# Altium schematic sheet loom-side-panel-right.SchDoc
size 297 x 209 mm
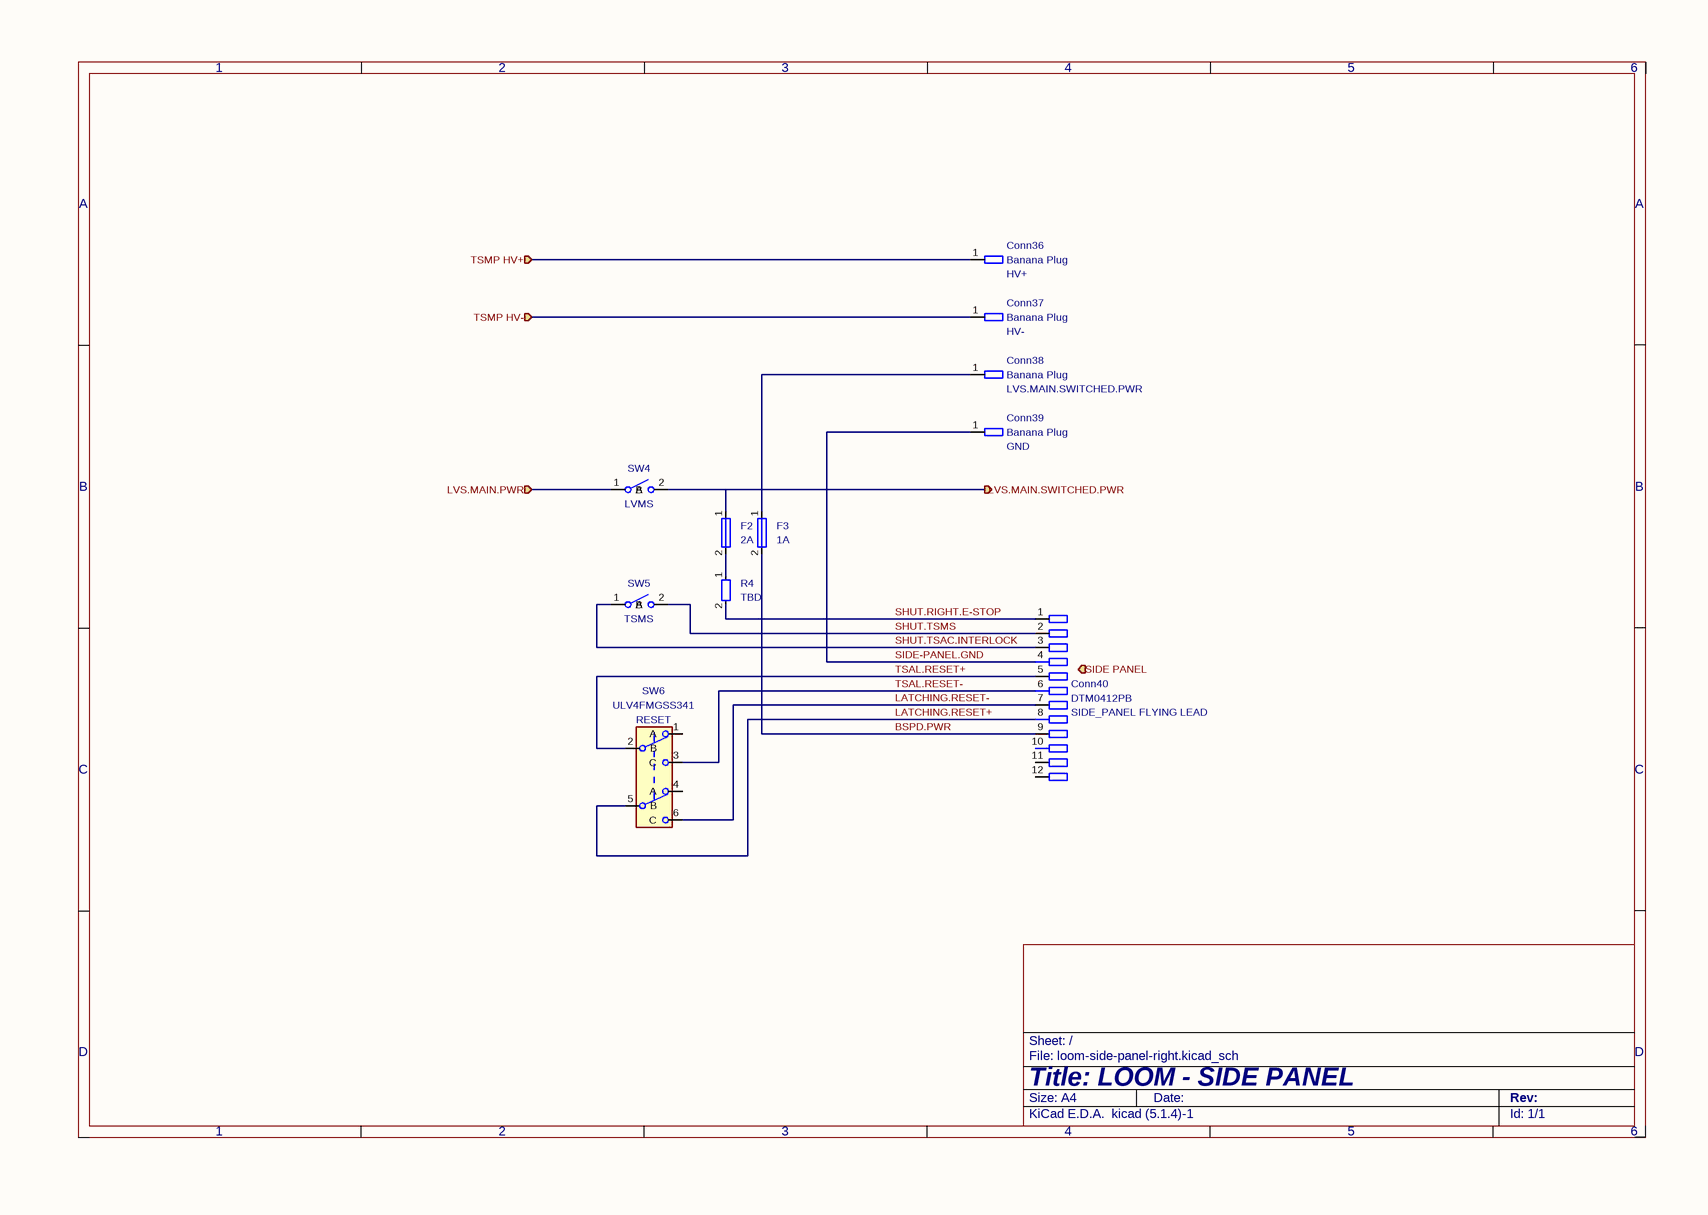
[diagram p0: loom-side-panel-right.SchDoc]

## Parts
Conn36  Connection Type: HV+  (hidden comment: Banana Plug)
Conn37  Connection Type: HV-  (hidden comment: Banana Plug)
Conn38  Connection Type: LVS.MAIN.SWITCHED.PWR  (hidden comment: Banana Plug)
Conn39  Connection Type: GND  (hidden comment: Banana Plug)
Conn40  P/N: DTM0412PB  Conn Name: SIDE_PANEL FLYING LEAD  (hidden comment: Deutsch_DTM_12P_Pin)
F2  2A
F3  1A
R4  TBD
SW4  LVMS
SW5  TSMS
SW6  Conn Name: RESET  (hidden comment: ULV4FMGSS341)

## Ports
LVS.MAIN.PWR (in), LVS.MAIN.SWITCHED.PWR (out), SIDE PANEL (in), TSMP HV+ (in), TSMP HV- (in)

## Nets
BSPD.PWR: Conn40.9 F3.2
LATCHING.RESET+: Conn40.8 SW6.5(B)
LATCHING.RESET-: Conn40.7 SW6.6(C)
LVS.MAIN.PWR: SW4.1(A) ; port LVS.MAIN.PWR
LVS.MAIN.SWITCHED.PWR: Conn38.1 F2.1 F3.1 SW4.2(B) ; port LVS.MAIN.SWITCHED.PWR
SHUT.RIGHT.E-STOP: Conn40.1 R4.2
SHUT.TSAC.INTERLOCK: Conn40.3 SW5.1(A)
SHUT.TSMS: Conn40.2 SW5.2(B)
SIDE-PANEL.GND: Conn39.1 Conn40.4
TSAL.RESET+: Conn40.5 SW6.2(B)
TSAL.RESET-: Conn40.6 SW6.3(C)
TSMP HV+: Conn36.1 ; port TSMP HV+
TSMP HV-: Conn37.1 ; port TSMP HV-
NetF2_2: F2.2 R4.1

Not connected (* = marked no-connect by the designer): Conn40 10 11 12; SW6 1(A) 4(A)

## Notes on the sheet
- 1
- 2
- 3
- 4
- 5
- 6
- A
- B
- C
- D
- Title: LOOM - SIDE PANEL
- File: loom-side-panel-right.kicad_sch
- Sheet: /
- KiCad E.D.A.  kicad (5.1.4)-1
- Size: A4
- Date:
- Rev:
- Id: 1/1

## Library data of the parts
F2 F3 = Fuse
  F2: Value: 2A
  F3: Value: 1A
R4 = R_Small: Value: TBD
SW4 SW5 = SW_SPST
  SW4: Value: LVMS
  SW5: Value: TSMS
SW6 = SW_Push_DPDT: Value: ULV4FMGSS341
Conn36-Conn39 = Banana Plug: Value: Banana Plug
Conn40 = Deutsch_DTM_12P_Pin: Value: Deutsch_DTM_12P_Pin